# Altium project FPGA_TempSens.PrjPcb
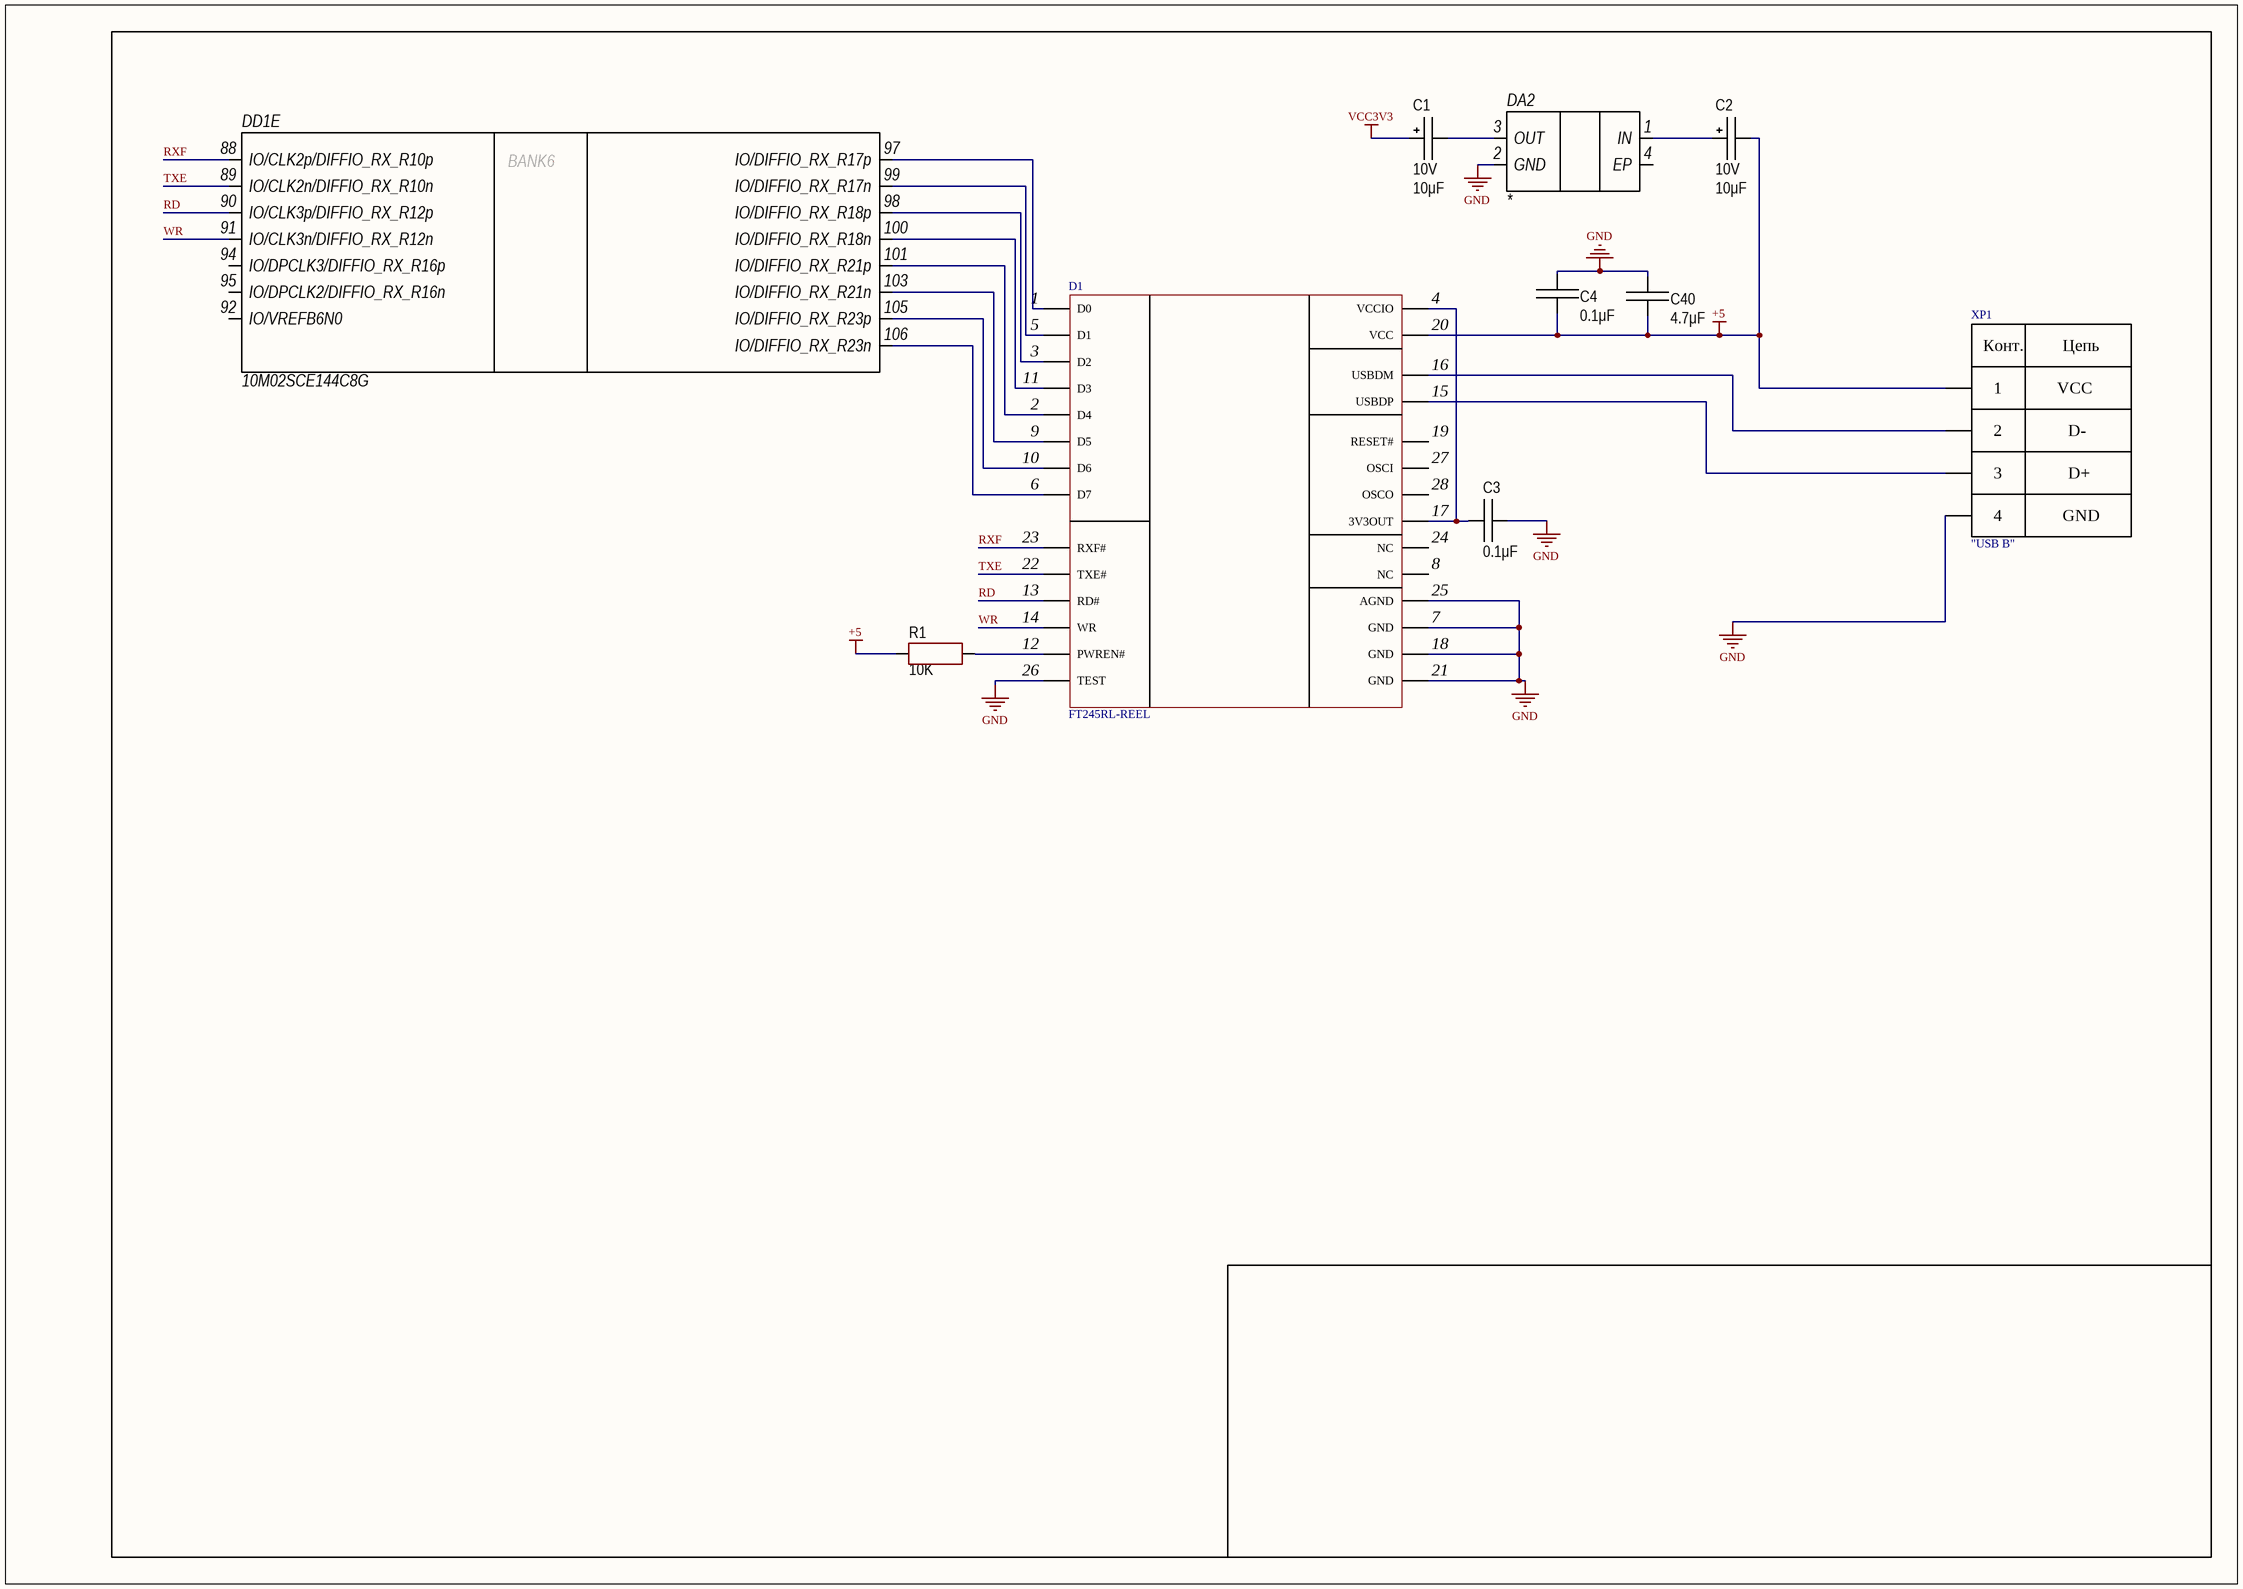
[diagram p0: Page1.SchDoc]
3 sheets, 58 parts. Net scope: global (net labels, ports and power ports of the same name join across sheets).
Board file: PCB.PcbDoc
Sheets:
  Page1.SchDoc
  Page2.SchDoc
  Connectors.SchDoc

## Sheet Page1.SchDoc
size 420 x 297 mm

### Parts
C1  value 10μF  Voltage: 10V  [CAP: TANTAL-A]
C2  value 10μF  Voltage: 10V  [CAP: TANTAL-A]
C3  value 0.1μF  [CAP: 0805]
C4  value 0.1μF  [CAP: 0805]
C40  value 4.7μF  [CAP: 0805]
D1  FT245RL-REEL  [28-SSOP]
DA2  *  [SOT-223]
DD1  10M02SCE144C8G  [144-Lead EQFP]  (part E of 7)
R1  value 10K  [RES: 0805]
XP1  "USB B"  [USB B]

### Nets
+5: C2.2 C4.1 C40.1 D1.20(VCC) R1.1 XP1.1
GND: C3.2 C4.2 C40.2 D1.7(GND) D1.18(GND) D1.21(GND) D1.25(AGND) D1.26(TEST) DA2.2(GND) XP1.4
VCC3V3: C1.1
RD: D1.13(RD#) DD1.90(IO/CLK3p/DIFFIO_RX_R12p)
RXF: D1.23(RXF#) DD1.88(IO/CLK2p/DIFFIO_RX_R10p)
TXE: D1.22(TXE#) DD1.89(IO/CLK2n/DIFFIO_RX_R10n)
WR: D1.14(WR) DD1.91(IO/CLK3n/DIFFIO_RX_R12n)
NetC1_2: C1.2 DA2.3(OUT)
NetC2_1: C2.1 DA2.1(IN)
NetC3_1: C3.1 D1.4(VCCIO) D1.17(3V3OUT)
NetD1_1: D1.1(D0) DD1.97(IO/DIFFIO_RX_R17p)
NetD1_2: D1.2(D4) DD1.101(IO/DIFFIO_RX_R21p)
NetD1_3: D1.3(D2) DD1.98(IO/DIFFIO_RX_R18p)
NetD1_5: D1.5(D1) DD1.99(IO/DIFFIO_RX_R17n)
NetD1_6: D1.6(D7) DD1.106(IO/DIFFIO_RX_R23n)
NetD1_9: D1.9(D5) DD1.103(IO/DIFFIO_RX_R21n)
NetD1_10: D1.10(D6) DD1.105(IO/DIFFIO_RX_R23p)
NetD1_11: D1.11(D3) DD1.100(IO/DIFFIO_RX_R18n)
NetD1_12: D1.12(PWREN#) R1.2
NetD1_15: D1.15(USBDP) XP1.3
NetD1_16: D1.16(USBDM) XP1.2

Not connected (* = marked no-connect by the designer): D1 8(NC) 19(RESET#) 24(NC) 27(OSCI) 28(OSCO); DA2 4(EP); DD1 92(IO/VREFB6N0) 94(IO/DPCLK3/DIFFIO_RX_R16p) 95(IO/DPCLK2/DIFFIO_RX_R16n)

### Notes on the sheet
- (in symbol 10M02SCE144C8G, part E) BANK6
- (in symbol USB B) Конт.; Цепь; VCC; D-; D+; GND

### Library data of the parts
C1 C2 = Tantal_A: PartNumber: F930J107KAAAJ6; ValueManufacturerPartNumber: Tantalum capacitor, 10μF, 10V, ±10%, 2Ohm, case A (3216), -55...+85°C; Impedance: 2Ohm; Tolerance: ±10%; TypeDielectric: X7R; TypeCapacitor: Tantalum capacitor; Package: case A (3216); HelpURL: https://www.digikey.com/product-detail/en/avx-corporation/F930J107KAAAJ6/478-12404-1-ND/9645231; Temperature: -55...+85°C
C3 C4 C40 = Ceramic_0805: Manufacturer: Yageo; PartNumber: CC0805KRX7R7BB104; TypeCapacitor: Ceramic capacitor; Tolerance: ±10%; TypeDielectric: X7R; Package: 0805; HelpURL: https://www.digikey.com/product-detail/en/yageo/CC0805KRX7R7BB104/311-1142-1-ND/303052; ValueManufacturerPartNumber: =TypeCapacitor+', '+Value+', '+TypeDielectric+', '+Tolerance+', '+Voltage+', '+Package+', '+Temperature; Temperature: -55...+125°C
D1 = FT245RL-REEL: IC USB TO PARALLEL FIFO 28-SSOP; Manufature: FTDI, Future Technology Devices International Ltd; Model: FT245RL-REEL; HelpURL: https://www.digikey.com/product-detail/en/ftdi-future-technology-devices-international-ltd/FT245RL-REEL/768-1011-2-ND/1836389; Case: 28-SSOP
DA2 = MIC5233: Voltage Regulator; PartNumber: MIC5233-3.3YS; Value: *; Case: *
DD1 = 10M02SCE144C8G: MAX10 FPGA; Manufacturer: Intel; Value: 10M02SCE144C8G; HelpUrl: https://www.digikey.com/product-detail/en/intel/10M02SCE144C8G/544-3098-ND/5284822; PartNumber: 10M02SCE144C8G
R1 = Resistor_0805: Manufacturer: Yageo; PartNumber: RC0805JR-07100RL; TypeResistor: Resistor film; Power: 0.125W; Package: 0805; HelpURL: https://www.digikey.com/product-detail/en/yageo/RC0805JR-07100RL/311-100ARCT-ND/731185; ValueManufacturerPartNumber: =TypeResistor+', '+Value+', '+Tolerance+', '+Package+', '+Power+', '+Temperature; Temperature: -55...+125°C
XP1 = USB B: Type Connector: USB type B; Manufacture: *; Part Number: *; URL: *

## Sheet Page2.SchDoc
size 420 x 297 mm
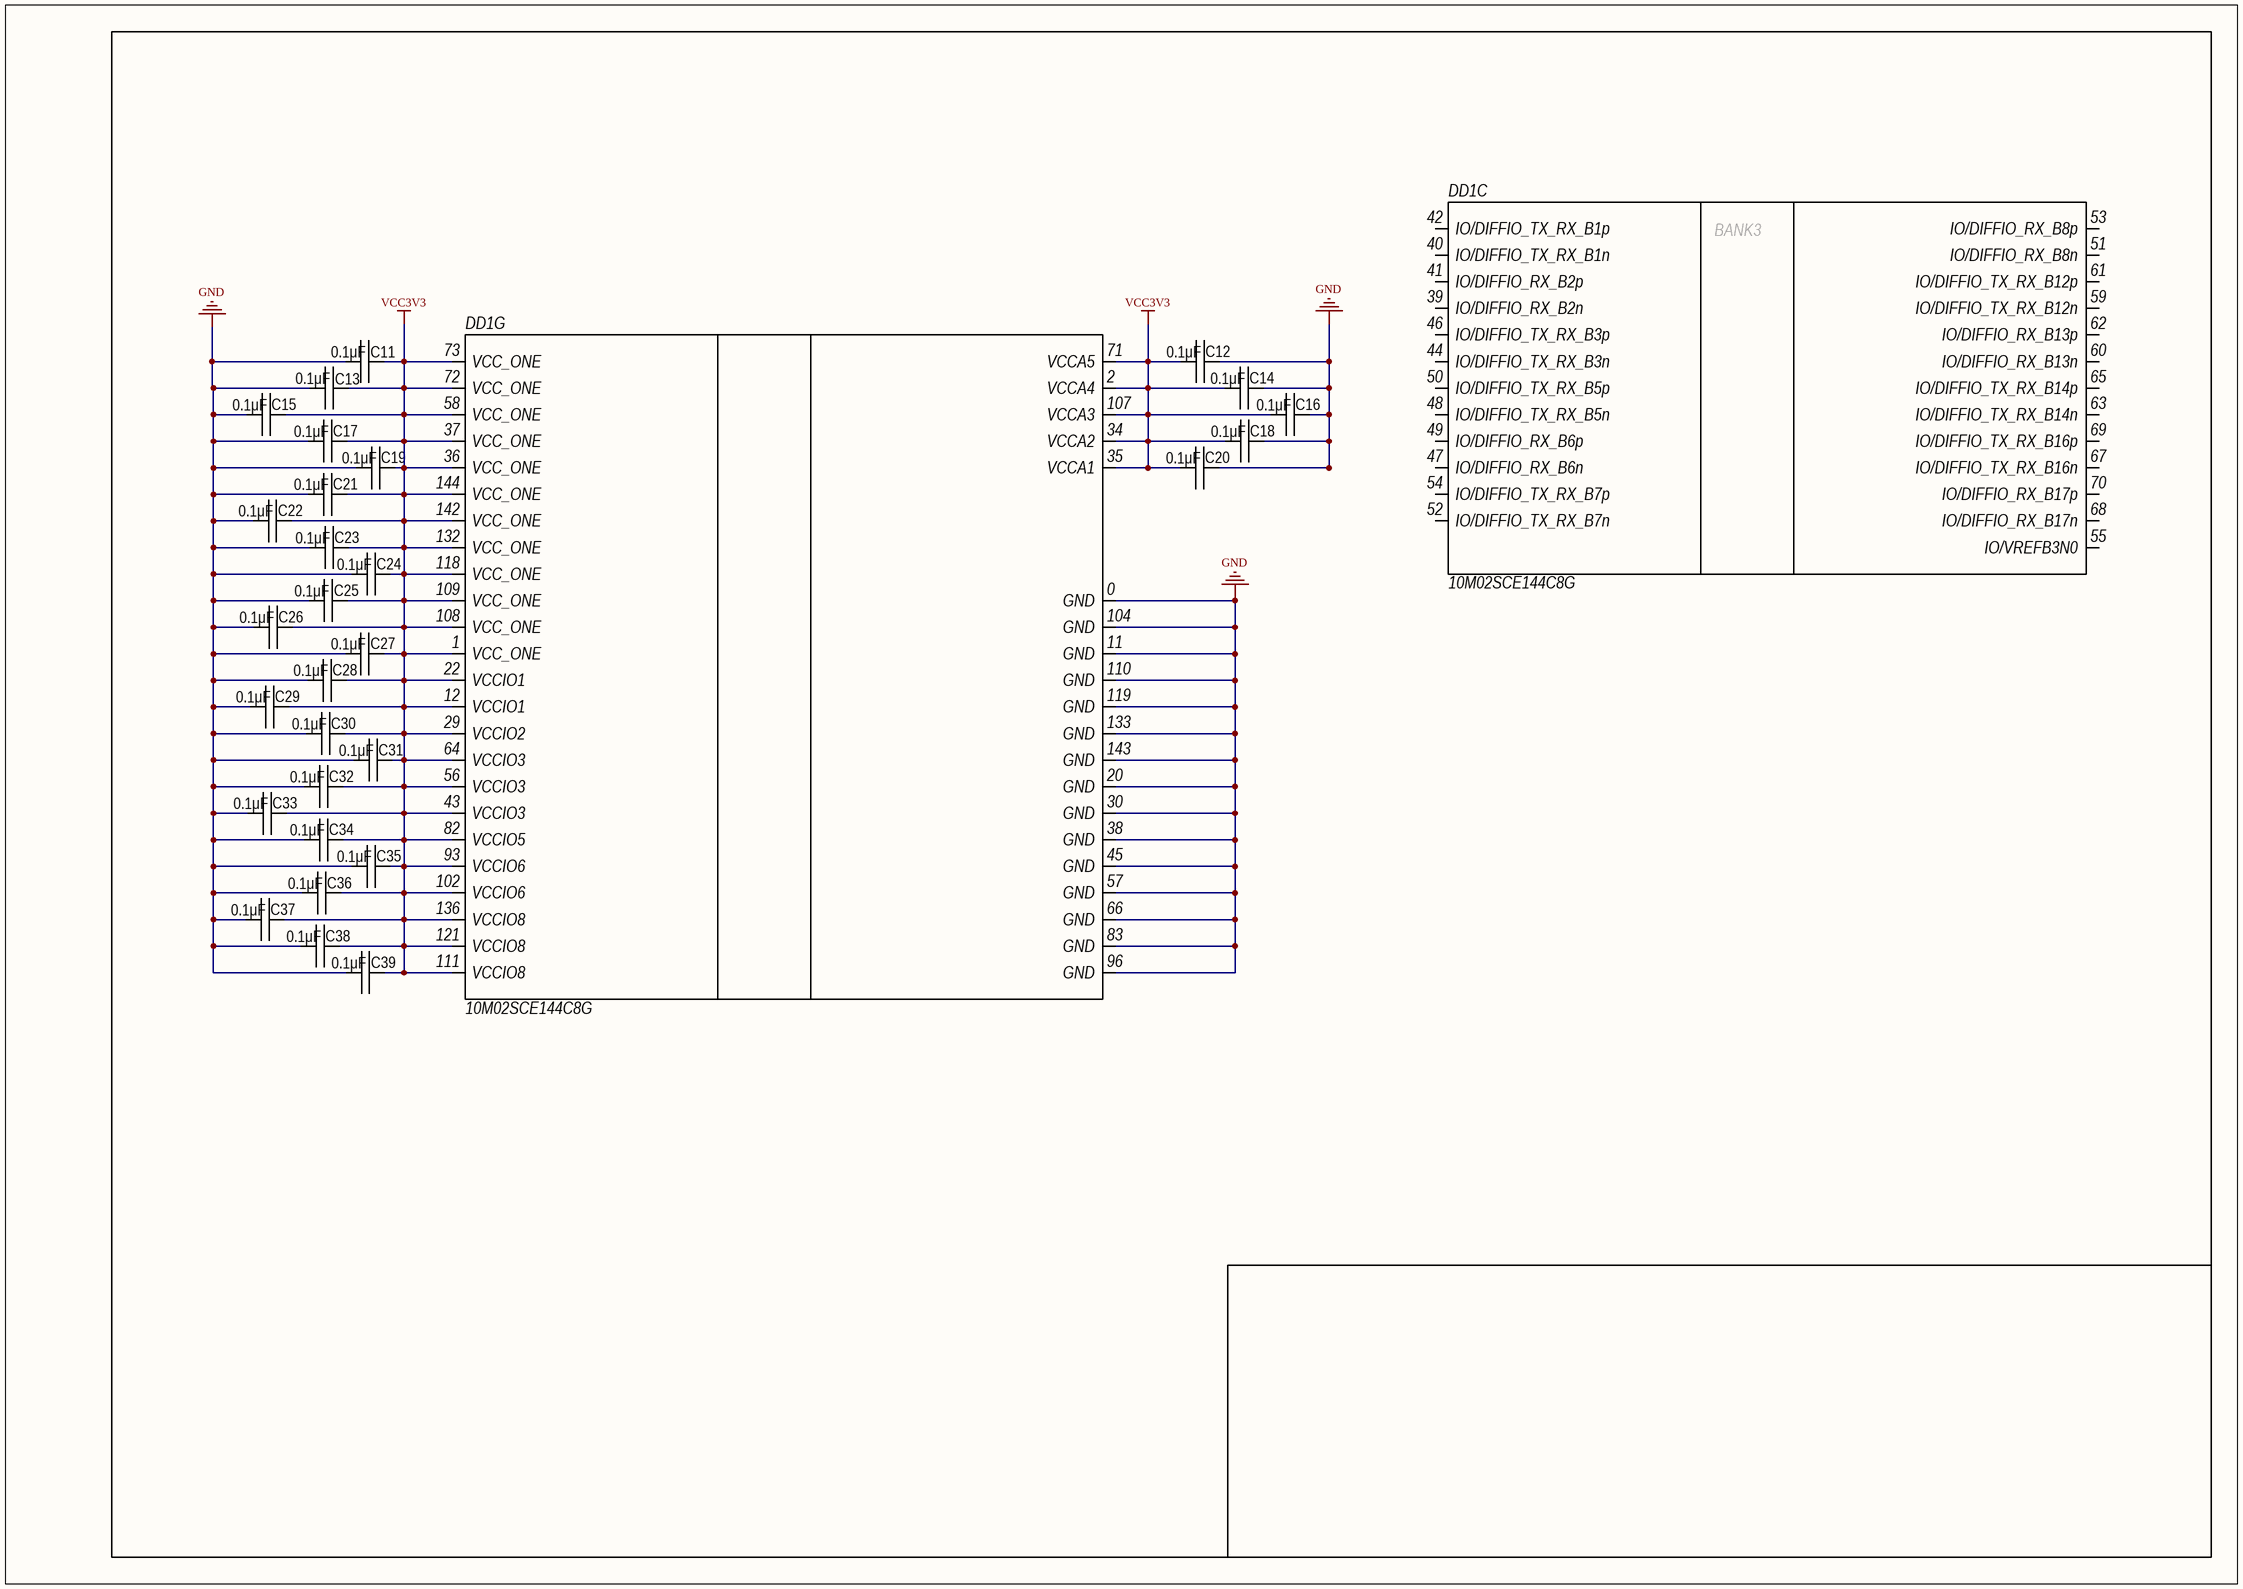
[diagram p1: Page2.SchDoc]

### Parts
C11  value 0.1μF  [CAP: 0805]
C12  value 0.1μF  [CAP: 0805]
C13  value 0.1μF  [CAP: 0805]
C14  value 0.1μF  [CAP: 0805]
C15  value 0.1μF  [CAP: 0805]
C16  value 0.1μF  [CAP: 0805]
C17  value 0.1μF  [CAP: 0805]
C18  value 0.1μF  [CAP: 0805]
C19  value 0.1μF  [CAP: 0805]
C20  value 0.1μF  [CAP: 0805]
C21  value 0.1μF  [CAP: 0805]
C22  value 0.1μF  [CAP: 0805]
C23  value 0.1μF  [CAP: 0805]
C24  value 0.1μF  [CAP: 0805]
C25  value 0.1μF  [CAP: 0805]
C26  value 0.1μF  [CAP: 0805]
C27  value 0.1μF  [CAP: 0805]
C28  value 0.1μF  [CAP: 0805]
C29  value 0.1μF  [CAP: 0805]
C30  value 0.1μF  [CAP: 0805]
C31  value 0.1μF  [CAP: 0805]
C32  value 0.1μF  [CAP: 0805]
C33  value 0.1μF  [CAP: 0805]
C34  value 0.1μF  [CAP: 0805]
C35  value 0.1μF  [CAP: 0805]
C36  value 0.1μF  [CAP: 0805]
C37  value 0.1μF  [CAP: 0805]
C38  value 0.1μF  [CAP: 0805]
C39  value 0.1μF  [CAP: 0805]
DD1  10M02SCE144C8G  [144-Lead EQFP]  (parts C,G of 7)

### Nets
GND: C11.2 C12.1 C13.2 C14.1 C15.2 C16.1 C17.2 C18.1 C19.2 C20.1 C21.2 C22.2 C23.2 C24.2 C25.2 C26.2 C27.2 C28.2 C29.2 C30.2 C31.2 C32.2 C33.2 C34.2 C35.2 C36.2 C37.2 C38.2 C39.2 DD1.0(GND) DD1.11(GND) DD1.20(GND) DD1.30(GND) DD1.38(GND) DD1.45(GND) DD1.57(GND) DD1.66(GND) DD1.83(GND) DD1.96(GND) DD1.104(GND) DD1.110(GND) DD1.119(GND) DD1.133(GND) DD1.143(GND)
VCC3V3: C11.1 C12.2 C13.1 C14.2 C15.1 C16.2 C17.1 C18.2 C19.1 C20.2 C21.1 C22.1 C23.1 C24.1 C25.1 C26.1 C27.1 C28.1 C29.1 C30.1 C31.1 C32.1 C33.1 C34.1 C35.1 C36.1 C37.1 C38.1 C39.1 DD1.1(VCC_ONE) DD1.2(VCCA4) DD1.12(VCCIO1) DD1.22(VCCIO1) DD1.29(VCCIO2) DD1.34(VCCA2) DD1.35(VCCA1) DD1.36(VCC_ONE) DD1.37(VCC_ONE) DD1.43(VCCIO3) DD1.56(VCCIO3) DD1.58(VCC_ONE) DD1.64(VCCIO3) DD1.71(VCCA5) DD1.72(VCC_ONE) DD1.73(VCC_ONE) DD1.82(VCCIO5) DD1.93(VCCIO6) DD1.102(VCCIO6) DD1.107(VCCA3) DD1.108(VCC_ONE) DD1.109(VCC_ONE) DD1.111(VCCIO8) DD1.118(VCC_ONE) DD1.121(VCCIO8) DD1.132(VCC_ONE) DD1.136(VCCIO8) DD1.142(VCC_ONE) DD1.144(VCC_ONE)

Not connected (* = marked no-connect by the designer): DD1 39(IO/DIFFIO_RX_B2n) 40(IO/DIFFIO_TX_RX_B1n) 41(IO/DIFFIO_RX_B2p) 42(IO/DIFFIO_TX_RX_B1p) 44(IO/DIFFIO_TX_RX_B3n) 46(IO/DIFFIO_TX_RX_B3p) 47(IO/DIFFIO_RX_B6n) 48(IO/DIFFIO_TX_RX_B5n) 49(IO/DIFFIO_RX_B6p) 50(IO/DIFFIO_TX_RX_B5p) 51(IO/DIFFIO_RX_B8n) 52(IO/DIFFIO_TX_RX_B7n) 53(IO/DIFFIO_RX_B8p) 54(IO/DIFFIO_TX_RX_B7p) 55(IO/VREFB3N0) 59(IO/DIFFIO_TX_RX_B12n) 60(IO/DIFFIO_RX_B13n) 61(IO/DIFFIO_TX_RX_B12p) 62(IO/DIFFIO_RX_B13p) 63(IO/DIFFIO_TX_RX_B14n) 65(IO/DIFFIO_TX_RX_B14p) 67(IO/DIFFIO_TX_RX_B16n) 68(IO/DIFFIO_RX_B17n) 69(IO/DIFFIO_TX_RX_B16p) 70(IO/DIFFIO_RX_B17p)

### Notes on the sheet
- (in symbol 10M02SCE144C8G, part C) BANK3

### Library data of the parts
C11-C39 = Ceramic_0805: ValueManufacturerPartNumber: Ceramic capacitor, 0.1μF, X7R, , , 0805,; TypeCapacitor: Ceramic capacitor; TypeDielectric: X7R; Package: 0805
DD1 = 10M02SCE144C8G: MAX10 FPGA; Manufacturer: Intel; Value: 10M02SCE144C8G; HelpUrl: https://www.digikey.com/product-detail/en/intel/10M02SCE144C8G/544-3098-ND/5284822; PartNumber: 10M02SCE144C8G

## Sheet Connectors.SchDoc
size 420 x 297 mm
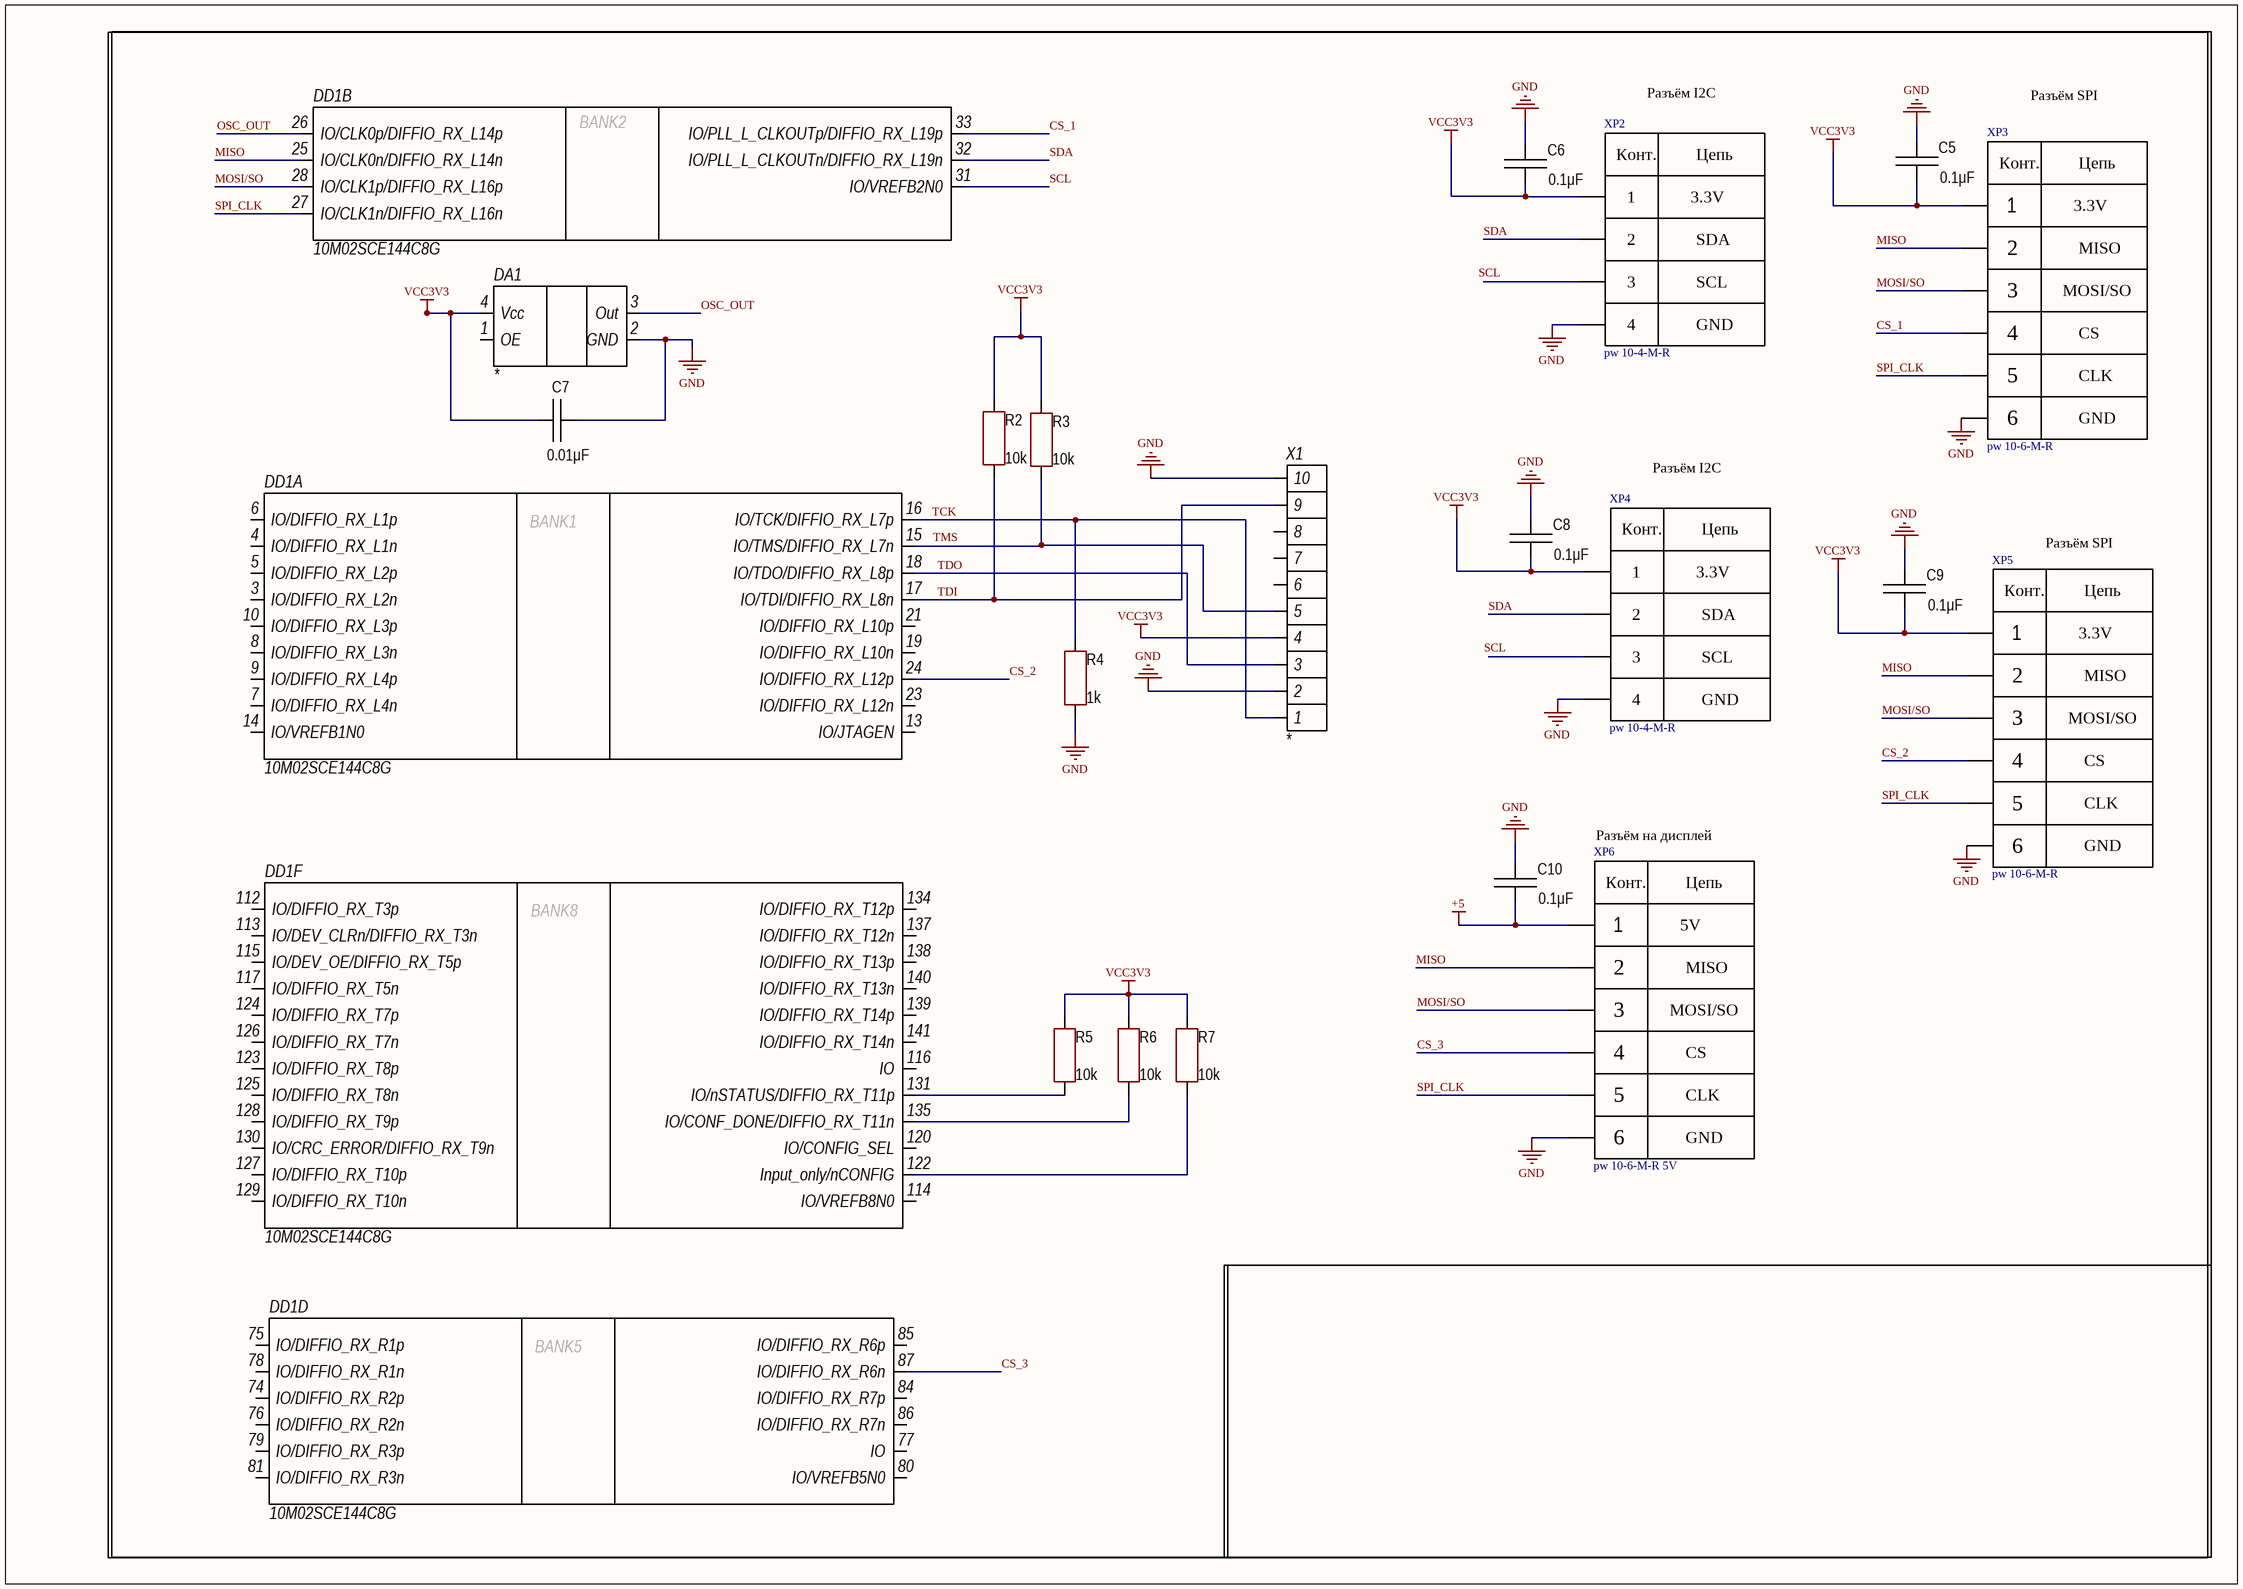
[diagram p2: Connectors.SchDoc]

### Parts
C5  value 0.1μF  [CAP: 0805]
C6  value 0.1μF  [CAP: 0805]
C7  value 0.01μF  [CAP: 0805]
C8  value 0.1μF  [CAP: 0805]
C9  value 0.1μF  [CAP: 0805]
C10  value 0.1μF  [CAP: 0805]
DA1  *  [4-SMD, NO LEAD]
DD1  10M02SCE144C8G  [144-Lead EQFP]  (parts A,B,D,F of 7)
R2  value 10k  [RES: 0805]
R3  value 10k  [RES: 0805]
R4  value 1k  [RES: 0805]
R5  value 10k  [RES: 0805]
R6  value 10k  [RES: 0805]
R7  value 10k  [RES: 0805]
X1  *  [IDC-10MS]
XP2  pw 10-4-M-R  [PW 10-4 - M - R]
XP3  pw 10-6-M-R  [PW 10-6-M]
XP4  pw 10-4-M-R  [PW 10-4 - M - R]
XP5  pw 10-6-M-R  [PW 10-6-M]
XP6  pw 10-6-M-R 5V  [PW 10-6-M]

### Nets
+5: C10.1 XP6.1
GND: C5.2 C6.2 C7.1 C8.2 C9.2 C10.2 DA1.2(GND) R4.1 X1.2 X1.10 XP2.4 XP3.6 XP4.4 XP5.6 XP6.6
VCC3V3: C5.1 C6.1 C7.2 C8.1 C9.1 DA1.4(Vcc) R2.2 R3.2 R5.2 R6.2 R7.2 X1.4 XP2.1 XP3.1 XP4.1 XP5.1
CS_1: DD1.33(IO/PLL_L_CLKOUTp/DIFFIO_RX_L19p) XP3.4
CS_2: DD1.24(IO/DIFFIO_RX_L12p) XP5.4
CS_3: DD1.87(IO/DIFFIO_RX_R6n) XP6.4
MISO: DD1.25(IO/CLK0n/DIFFIO_RX_L14n) XP3.2 XP5.2 XP6.2
MOSI/SO: DD1.28(IO/CLK1p/DIFFIO_RX_L16p) XP3.3 XP5.3 XP6.3
OSC_OUT: DA1.3(Out) DD1.26(IO/CLK0p/DIFFIO_RX_L14p)
SCL: DD1.31(IO/VREFB2N0)
SDA: DD1.32(IO/PLL_L_CLKOUTn/DIFFIO_RX_L19n) XP2.2 XP4.2
SPI_CLK: DD1.27(IO/CLK1n/DIFFIO_RX_L16n) XP3.5 XP5.5 XP6.5
TCK: DD1.16(IO/TCK/DIFFIO_RX_L7p) R4.2 X1.1
TDI: DD1.17(IO/TDI/DIFFIO_RX_L8n) R2.1 X1.9
TDO: DD1.18(IO/TDO/DIFFIO_RX_L8p) X1.3
NetDD1_15: DD1.15(IO/TMS/DIFFIO_RX_L7n) R3.1 X1.5
NetDD1_122: DD1.122(Input_only/nCONFIG) R7.1
NetDD1_131: DD1.131(IO/nSTATUS/DIFFIO_RX_T11p) R5.1
NetDD1_135: DD1.135(IO/CONF_DONE/DIFFIO_RX_T11n) R6.1

Not connected (* = marked no-connect by the designer): DA1 1(OE); DD1 3(IO/DIFFIO_RX_L2n) 4(IO/DIFFIO_RX_L1n) 5(IO/DIFFIO_RX_L2p) 6(IO/DIFFIO_RX_L1p) 7(IO/DIFFIO_RX_L4n) 8(IO/DIFFIO_RX_L3n) 9(IO/DIFFIO_RX_L4p) 10(IO/DIFFIO_RX_L3p) 13(IO/JTAGEN) 14(IO/VREFB1N0) 19(IO/DIFFIO_RX_L10n) 21(IO/DIFFIO_RX_L10p) 23(IO/DIFFIO_RX_L12n) 74(IO/DIFFIO_RX_R2p) 75(IO/DIFFIO_RX_R1p) 76(IO/DIFFIO_RX_R2n) 77(IO) 78(IO/DIFFIO_RX_R1n) 79(IO/DIFFIO_RX_R3p) 80(IO/VREFB5N0) 81(IO/DIFFIO_RX_R3n) 84(IO/DIFFIO_RX_R7p) 85(IO/DIFFIO_RX_R6p) 86(IO/DIFFIO_RX_R7n) 112(IO/DIFFIO_RX_T3p) 113(IO/DEV_CLRn/DIFFIO_RX_T3n) 114(IO/VREFB8N0) 115(IO/DEV_OE/DIFFIO_RX_T5p) 116(IO) 117(IO/DIFFIO_RX_T5n) 120(IO/CONFIG_SEL) 123(IO/DIFFIO_RX_T8p) 124(IO/DIFFIO_RX_T7p) 125(IO/DIFFIO_RX_T8n) 126(IO/DIFFIO_RX_T7n) 127(IO/DIFFIO_RX_T10p) 128(IO/DIFFIO_RX_T9p) 129(IO/DIFFIO_RX_T10n) 130(IO/CRC_ERROR/DIFFIO_RX_T9n) 134(IO/DIFFIO_RX_T12p) 137(IO/DIFFIO_RX_T12n) 138(IO/DIFFIO_RX_T13p) 139(IO/DIFFIO_RX_T14p) 140(IO/DIFFIO_RX_T13n) 141(IO/DIFFIO_RX_T14n); X1 6 7 8; XP2 3; XP4 3

### Notes on the sheet
- Разъём I2C
- Разъём SPI
- Разъём на дисплей
- Labels drawn without touching a wire or pin: SCL, TMS
- (in symbol 10M02SCE144C8G, part A) BANK1
- (in symbol 10M02SCE144C8G, part B) BANK2
- (in symbol 10M02SCE144C8G, part D) BANK5
- (in symbol 10M02SCE144C8G, part F) BANK8
- (in symbol pw 10-4-M-R) Конт.; Цепь; 3.3V; SDA; SCL; GND
- (in symbol pw 10-6-M-R) Конт.; Цепь; 3.3V; MISO; MOSI/SO; CS; CLK; GND
- (in symbol pw 10-6-M-R 5V) Конт.; Цепь; 5V; MISO; MOSI/SO; CS; CLK; GND

### Library data of the parts
C5 C6 C8-C10 = Ceramic_0805: as C11 on sheet Page2; Package: 0805
C7 = Ceramic_0805: ValueManufacturerPartNumber: Ceramic capacitor, 0.01μF, X7R, , , 0805,; TypeCapacitor: Ceramic capacitor; TypeDielectric: X7R; Package: 0805
DA1 = SG 8002: Oscillator; Manufacturer: EPSON; HelpUrl: https://support.epson.biz/td/api/doc_check.php?dl=brief_SG-8002CA&lang=en; PartNumber: *; Value: *
DD1 = 10M02SCE144C8G: MAX10 FPGA; Manufacturer: Intel; Value: 10M02SCE144C8G; HelpUrl: https://www.digikey.com/product-detail/en/intel/10M02SCE144C8G/544-3098-ND/5284822; PartNumber: 10M02SCE144C8G
R2 R3 R5-R7 = Resistor_0805: ValueManufacturerPartNumber: Resistor film, 10k, , 0805, ,; TypeResistor: Resistor film; Package: 0805
R4 = Resistor_0805: ValueManufacturerPartNumber: Resistor film, 1k, , 0805, ,; TypeResistor: Resistor film; Package: 0805
X1 = Connector 10-pin: Connector; Manufacturer: *; Value: *

## Nets that join several sheets
+5: Page1 (6 pins), Connectors (C10.1 XP6.1)
GND: Page1 (10 pins), Page2 (44 pins), Connectors (15 pins)
VCC3V3: Page1 (C1.1), Page2 (58 pins), Connectors (16 pins)